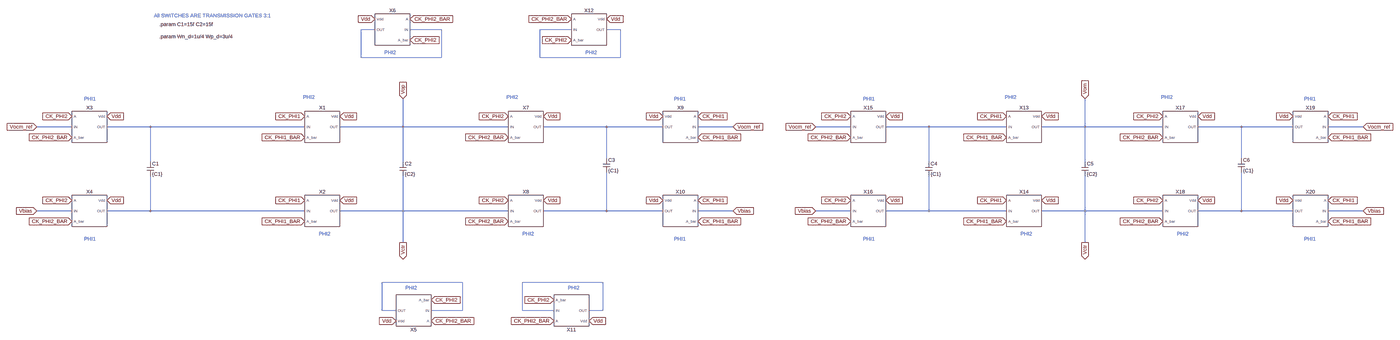
[diagram p0: schematic Draft5.asc, whole sheet]
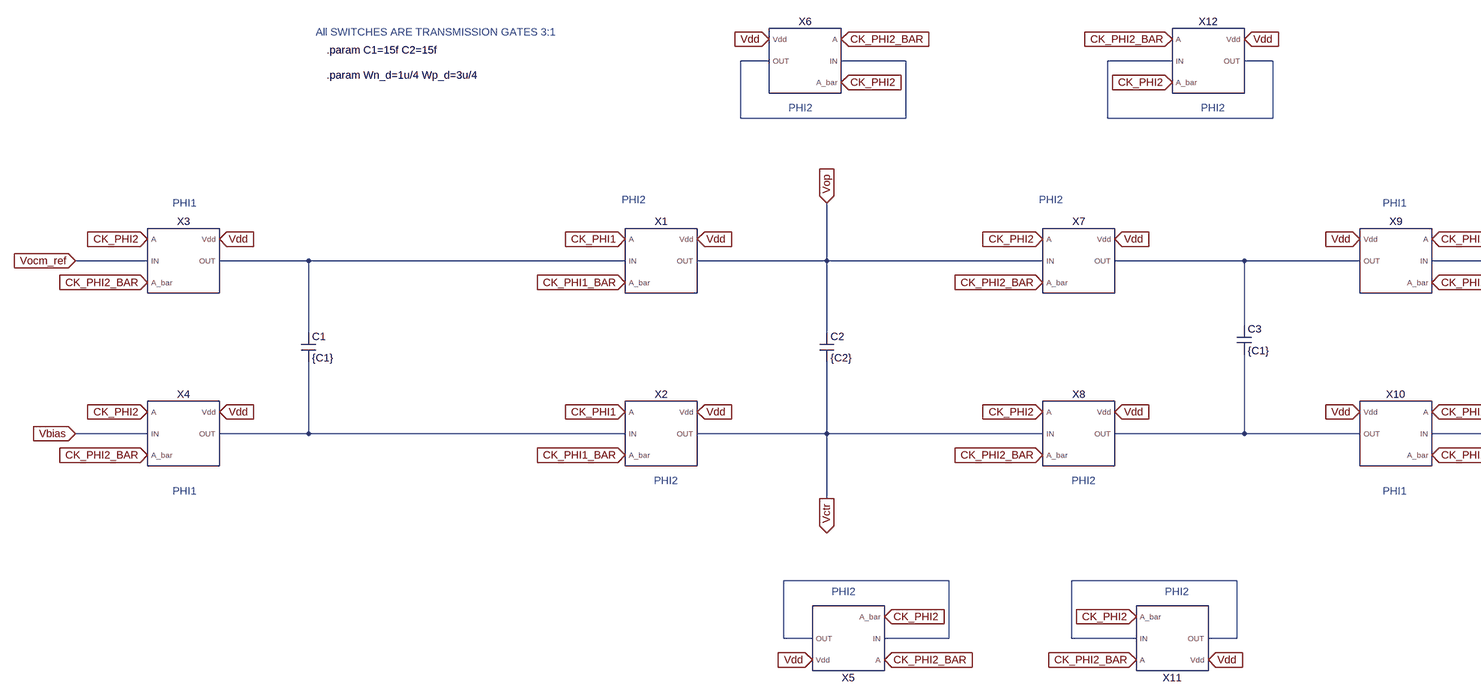
[diagram p1: schematic Draft5.asc, part, row 1 of 1, column 1 of 2]
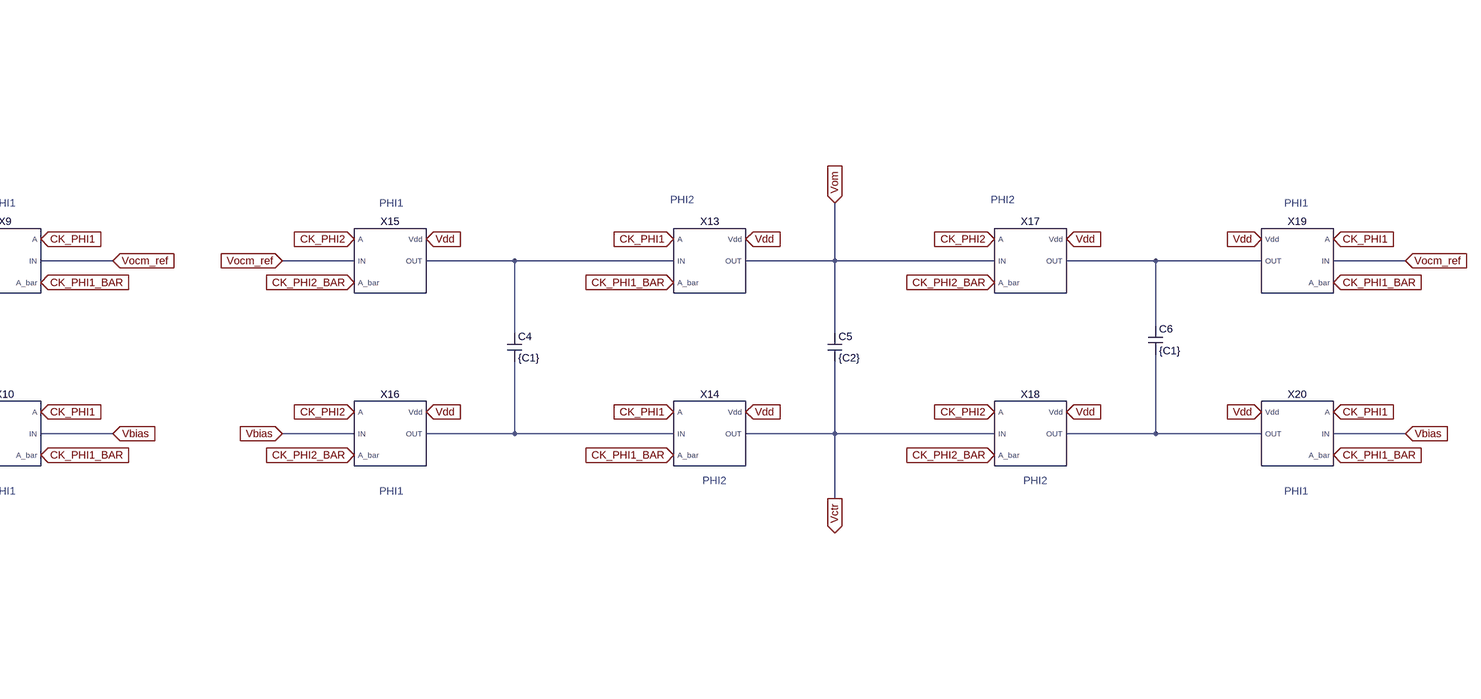
[diagram p2: schematic Draft5.asc, part, row 1 of 1, column 2 of 2]
Draft5.asc, the LTspice schematic file:
Version 4
SHEET 1 4840 1400
WIRE -736 -560 -800 -560
WIRE -432 -560 -576 -560
WIRE 160 -560 16 -560
WIRE 384 -560 320 -560
WIRE -800 -432 -800 -560
WIRE -432 -432 -432 -560
WIRE -432 -432 -800 -432
WIRE 16 -432 16 -560
WIRE 384 -432 384 -560
WIRE 384 -432 16 -432
WIRE -2128 16 -2288 16
WIRE -1760 16 -1968 16
WIRE -1056 16 -1760 16
WIRE -608 16 -608 -112
WIRE -608 16 -896 16
WIRE -128 16 -608 16
WIRE 320 16 32 16
WIRE 592 16 320 16
WIRE 912 16 752 16
WIRE 1632 16 1472 16
WIRE 2000 16 1792 16
WIRE 2704 16 2000 16
WIRE 3152 16 3152 -112
WIRE 3152 16 2864 16
WIRE 3632 16 3152 16
WIRE 4080 16 3792 16
WIRE 4352 16 4080 16
WIRE 4672 16 4512 16
WIRE 320 160 320 16
WIRE 4080 160 4080 16
WIRE -1760 176 -1760 16
WIRE -608 176 -608 16
WIRE 2000 176 2000 16
WIRE 3152 176 3152 16
WIRE -2128 400 -2288 400
WIRE -1760 400 -1760 240
WIRE -1760 400 -1968 400
WIRE -1056 400 -1760 400
WIRE -608 400 -608 240
WIRE -608 400 -896 400
WIRE -128 400 -608 400
WIRE 320 400 320 224
WIRE 320 400 32 400
WIRE 592 400 320 400
WIRE 912 400 752 400
WIRE 1632 400 1472 400
WIRE 2000 400 2000 240
WIRE 2000 400 1792 400
WIRE 2704 400 2000 400
WIRE 3152 400 3152 240
WIRE 3152 400 2864 400
WIRE 3632 400 3152 400
WIRE 4080 400 4080 224
WIRE 4080 400 3792 400
WIRE 4352 400 4080 400
WIRE 4672 400 4512 400
WIRE -608 544 -608 400
WIRE 3152 544 3152 400
WIRE -336 1152 -704 1152
WIRE 304 1152 -64 1152
WIRE -704 1280 -704 1152
WIRE -640 1280 -704 1280
WIRE -336 1280 -336 1152
WIRE -336 1280 -480 1280
WIRE -64 1280 -64 1152
WIRE 80 1280 -64 1280
WIRE 304 1280 304 1152
WIRE 304 1280 240 1280
FLAG -2288 16 Vocm_ref
IOPIN -2288 16 In
FLAG -608 -112 Vop
IOPIN -608 -112 In
FLAG -1968 -32 Vdd
IOPIN -1968 -32 In
FLAG -896 -32 Vdd
IOPIN -896 -32 In
FLAG -896 352 Vdd
IOPIN -896 352 In
FLAG -1968 352 Vdd
IOPIN -1968 352 In
FLAG -2128 -32 CK_PHI2
IOPIN -2128 -32 In
FLAG -2128 352 CK_PHI2
IOPIN -2128 352 In
FLAG -1056 -32 CK_PHI1
IOPIN -1056 -32 In
FLAG -1056 352 CK_PHI1
IOPIN -1056 352 In
FLAG -2128 64 CK_PHI2_BAR
IOPIN -2128 64 In
FLAG -2128 448 CK_PHI2_BAR
IOPIN -2128 448 In
FLAG -1056 64 CK_PHI1_BAR
IOPIN -1056 64 In
FLAG -1056 448 CK_PHI1_BAR
IOPIN -1056 448 In
FLAG -2288 400 Vbias
IOPIN -2288 400 In
FLAG -608 544 Vctr
IOPIN -608 544 Out
FLAG -640 1328 Vdd
IOPIN -640 1328 In
FLAG -480 1328 CK_PHI2_BAR
IOPIN -480 1328 In
FLAG -480 1232 CK_PHI2
IOPIN -480 1232 In
FLAG -736 -608 Vdd
IOPIN -736 -608 In
FLAG -576 -608 CK_PHI2_BAR
IOPIN -576 -608 In
FLAG -576 -512 CK_PHI2
IOPIN -576 -512 In
FLAG 240 1328 Vdd
IOPIN 240 1328 In
FLAG 80 1328 CK_PHI2_BAR
IOPIN 80 1328 In
FLAG 80 1232 CK_PHI2
IOPIN 80 1232 In
FLAG 320 -608 Vdd
IOPIN 320 -608 In
FLAG 160 -608 CK_PHI2_BAR
IOPIN 160 -608 In
FLAG 160 -512 CK_PHI2
IOPIN 160 -512 In
FLAG 32 -32 Vdd
IOPIN 32 -32 In
FLAG 32 352 Vdd
IOPIN 32 352 In
FLAG -128 -32 CK_PHI2
IOPIN -128 -32 In
FLAG -128 352 CK_PHI2
IOPIN -128 352 In
FLAG -128 64 CK_PHI2_BAR
IOPIN -128 64 In
FLAG -128 448 CK_PHI2_BAR
IOPIN -128 448 In
FLAG 912 16 Vocm_ref
IOPIN 912 16 In
FLAG 592 -32 Vdd
IOPIN 592 -32 In
FLAG 592 352 Vdd
IOPIN 592 352 In
FLAG 752 -32 CK_PHI1
IOPIN 752 -32 In
FLAG 752 352 CK_PHI1
IOPIN 752 352 In
FLAG 752 64 CK_PHI1_BAR
IOPIN 752 64 In
FLAG 752 448 CK_PHI1_BAR
IOPIN 752 448 In
FLAG 912 400 Vbias
IOPIN 912 400 In
FLAG 1472 16 Vocm_ref
IOPIN 1472 16 In
FLAG 3152 -112 Vom
IOPIN 3152 -112 In
FLAG 1792 -32 Vdd
IOPIN 1792 -32 In
FLAG 2864 -32 Vdd
IOPIN 2864 -32 In
FLAG 2864 352 Vdd
IOPIN 2864 352 In
FLAG 1792 352 Vdd
IOPIN 1792 352 In
FLAG 1632 -32 CK_PHI2
IOPIN 1632 -32 In
FLAG 1632 352 CK_PHI2
IOPIN 1632 352 In
FLAG 2704 -32 CK_PHI1
IOPIN 2704 -32 In
FLAG 2704 352 CK_PHI1
IOPIN 2704 352 In
FLAG 1632 64 CK_PHI2_BAR
IOPIN 1632 64 In
FLAG 1632 448 CK_PHI2_BAR
IOPIN 1632 448 In
FLAG 2704 64 CK_PHI1_BAR
IOPIN 2704 64 In
FLAG 2704 448 CK_PHI1_BAR
IOPIN 2704 448 In
FLAG 1472 400 Vbias
IOPIN 1472 400 In
FLAG 3152 544 Vctr
IOPIN 3152 544 Out
FLAG 3792 -32 Vdd
IOPIN 3792 -32 In
FLAG 3792 352 Vdd
IOPIN 3792 352 In
FLAG 3632 -32 CK_PHI2
IOPIN 3632 -32 In
FLAG 3632 352 CK_PHI2
IOPIN 3632 352 In
FLAG 3632 64 CK_PHI2_BAR
IOPIN 3632 64 In
FLAG 3632 448 CK_PHI2_BAR
IOPIN 3632 448 In
FLAG 4672 16 Vocm_ref
IOPIN 4672 16 In
FLAG 4352 -32 Vdd
IOPIN 4352 -32 In
FLAG 4352 352 Vdd
IOPIN 4352 352 In
FLAG 4512 -32 CK_PHI1
IOPIN 4512 -32 In
FLAG 4512 352 CK_PHI1
IOPIN 4512 352 In
FLAG 4512 64 CK_PHI1_BAR
IOPIN 4512 64 In
FLAG 4512 448 CK_PHI1_BAR
IOPIN 4512 448 In
FLAG 4672 400 Vbias
IOPIN 4672 400 In
SYMBOL tgate -976 16 R0
SYMATTR InstName X1
SYMBOL tgate -976 400 R0
SYMATTR InstName X2
SYMBOL tgate -2048 16 R0
SYMATTR InstName X3
SYMBOL tgate -2048 400 R0
SYMATTR InstName X4
SYMBOL cap -1776 176 R0
SYMATTR InstName C1
SYMATTR Value {C1}
SYMBOL cap -624 176 R0
SYMATTR InstName C2
SYMATTR Value {C2}
SYMBOL tgate -560 1280 R180
SYMATTR SpiceLine L=0.28u Wn={Wn_d} Wp={Wp_d} M=1
SYMATTR InstName X5
SYMBOL tgate -656 -560 M0
SYMATTR SpiceLine L=0.28u Wn={Wn_d} Wp={Wp_d} M=1
SYMATTR InstName X6
SYMBOL tgate 160 1280 M180
SYMATTR SpiceLine L=0.28u Wn={Wn_d} Wp={Wp_d} M=1
SYMATTR InstName X11
SYMBOL tgate 240 -560 R0
SYMATTR SpiceLine L=0.28u Wn={Wn_d} Wp={Wp_d} M=1
SYMATTR InstName X12
SYMBOL tgate -48 16 R0
SYMATTR InstName X7
SYMBOL tgate -48 400 R0
SYMATTR InstName X8
SYMBOL tgate 672 16 M0
SYMATTR InstName X9
SYMBOL tgate 672 400 M0
SYMATTR InstName X10
SYMBOL cap 304 160 R0
SYMATTR InstName C3
SYMATTR Value {C1}
SYMBOL tgate 2784 16 R0
SYMATTR InstName X13
SYMBOL tgate 2784 400 R0
SYMATTR InstName X14
SYMBOL tgate 1712 16 R0
SYMATTR InstName X15
SYMBOL tgate 1712 400 R0
SYMATTR InstName X16
SYMBOL cap 1984 176 R0
SYMATTR InstName C4
SYMATTR Value {C1}
SYMBOL cap 3136 176 R0
SYMATTR InstName C5
SYMATTR Value {C2}
SYMBOL tgate 3712 16 R0
SYMATTR InstName X17
SYMBOL tgate 3712 400 R0
SYMATTR InstName X18
SYMBOL tgate 4432 16 M0
SYMATTR InstName X19
SYMBOL tgate 4432 400 M0
SYMATTR InstName X20
SYMBOL cap 4064 160 R0
SYMATTR InstName C6
SYMATTR Value {C1}
TEXT -1064 -120 Left 2 ;PHI2
TEXT -992 504 Left 2 ;PHI2
TEXT -2072 -112 Left 2 ;PHI1
TEXT -2072 528 Left 2 ;PHI1
TEXT -1720 -584 Left 2 !.param C1=15f C2=15f
TEXT -1744 -624 Left 2 ;All SWITCHES ARE TRANSMISSION GATES 3:1
TEXT -544 1176 Right 2 ;PHI2
TEXT -1720 -528 Left 2 !.param Wn_d=1u/4 Wp_d=3u/4
TEXT -640 -456 Right 2 ;PHI2
TEXT 144 1176 Left 2 ;PHI2
TEXT 224 -456 Left 2 ;PHI2
TEXT -136 -120 Left 2 ;PHI2
TEXT -64 504 Left 2 ;PHI2
TEXT 696 -112 Right 2 ;PHI1
TEXT 696 528 Right 2 ;PHI1
TEXT 2696 -120 Left 2 ;PHI2
TEXT 2768 504 Left 2 ;PHI2
TEXT 1688 -112 Left 2 ;PHI1
TEXT 1688 528 Left 2 ;PHI1
TEXT 3624 -120 Left 2 ;PHI2
TEXT 3696 504 Left 2 ;PHI2
TEXT 4456 -112 Right 2 ;PHI1
TEXT 4456 528 Right 2 ;PHI1

The netlist it stands for:
* Draft5.asc
XX1 CK_PHI1 CK_PHI1_BAR N003 Vdd Vop tgate L=0.28u Wn=1u Wp=3u M=1  ; pins A A_bar IN Vdd OUT
XX2 CK_PHI1 CK_PHI1_BAR N007 Vdd Vctr tgate L=0.28u Wn=1u Wp=3u M=1  ; pins A A_bar IN Vdd OUT
XX3 CK_PHI2 CK_PHI2_BAR Vocm_ref Vdd N003 tgate L=0.28u Wn=1u Wp=3u M=1  ; pins A A_bar IN Vdd OUT
XX4 CK_PHI2 CK_PHI2_BAR Vbias Vdd N007 tgate L=0.28u Wn=1u Wp=3u M=1  ; pins A A_bar IN Vdd OUT
C1 N003 N007 {C1}
C2 Vop Vctr {C2}
XX5 CK_PHI2_BAR CK_PHI2 N011 Vdd N011 tgate L=0.28u Wn={Wn_d} Wp={Wp_d} M=1  ; pins A A_bar IN Vdd OUT
XX6 CK_PHI2_BAR CK_PHI2 N001 Vdd N001 tgate L=0.28u Wn={Wn_d} Wp={Wp_d} M=1  ; pins A A_bar IN Vdd OUT
XX11 CK_PHI2_BAR CK_PHI2 N012 Vdd N012 tgate L=0.28u Wn={Wn_d} Wp={Wp_d} M=1  ; pins A A_bar IN Vdd OUT
XX12 CK_PHI2_BAR CK_PHI2 N002 Vdd N002 tgate L=0.28u Wn={Wn_d} Wp={Wp_d} M=1  ; pins A A_bar IN Vdd OUT
XX7 CK_PHI2 CK_PHI2_BAR Vop Vdd N004 tgate L=0.28u Wn=1u Wp=3u M=1  ; pins A A_bar IN Vdd OUT
XX8 CK_PHI2 CK_PHI2_BAR Vctr Vdd N008 tgate L=0.28u Wn=1u Wp=3u M=1  ; pins A A_bar IN Vdd OUT
XX9 CK_PHI1 CK_PHI1_BAR Vocm_ref Vdd N004 tgate L=0.28u Wn=1u Wp=3u M=1  ; pins A A_bar IN Vdd OUT
XX10 CK_PHI1 CK_PHI1_BAR Vbias Vdd N008 tgate L=0.28u Wn=1u Wp=3u M=1  ; pins A A_bar IN Vdd OUT
C3 N004 N008 {C1}
XX13 CK_PHI1 CK_PHI1_BAR N005 Vdd Vom tgate L=0.28u Wn=1u Wp=3u M=1  ; pins A A_bar IN Vdd OUT
XX14 CK_PHI1 CK_PHI1_BAR N009 Vdd Vctr tgate L=0.28u Wn=1u Wp=3u M=1  ; pins A A_bar IN Vdd OUT
XX15 CK_PHI2 CK_PHI2_BAR Vocm_ref Vdd N005 tgate L=0.28u Wn=1u Wp=3u M=1  ; pins A A_bar IN Vdd OUT
XX16 CK_PHI2 CK_PHI2_BAR Vbias Vdd N009 tgate L=0.28u Wn=1u Wp=3u M=1  ; pins A A_bar IN Vdd OUT
C4 N005 N009 {C1}
C5 Vom Vctr {C2}
XX17 CK_PHI2 CK_PHI2_BAR Vom Vdd N006 tgate L=0.28u Wn=1u Wp=3u M=1  ; pins A A_bar IN Vdd OUT
XX18 CK_PHI2 CK_PHI2_BAR Vctr Vdd N010 tgate L=0.28u Wn=1u Wp=3u M=1  ; pins A A_bar IN Vdd OUT
XX19 CK_PHI1 CK_PHI1_BAR Vocm_ref Vdd N006 tgate L=0.28u Wn=1u Wp=3u M=1  ; pins A A_bar IN Vdd OUT
XX20 CK_PHI1 CK_PHI1_BAR Vbias Vdd N010 tgate L=0.28u Wn=1u Wp=3u M=1  ; pins A A_bar IN Vdd OUT
C6 N006 N010 {C1}
* PHI2
* PHI2
* PHI1
* PHI1
.param C1=15f C2=15f
* All SWITCHES ARE TRANSMISSION GATES 3:1
* PHI2
.param Wn_d=1u/4 Wp_d=3u/4
* PHI2
* PHI2
* PHI2
* PHI2
* PHI2
* PHI1
* PHI1
* PHI2
* PHI2
* PHI1
* PHI1
* PHI2
* PHI2
* PHI1
* PHI1
.backanno
.end